# Altium schematic sheet Display_System_sch.SchDoc
size A3
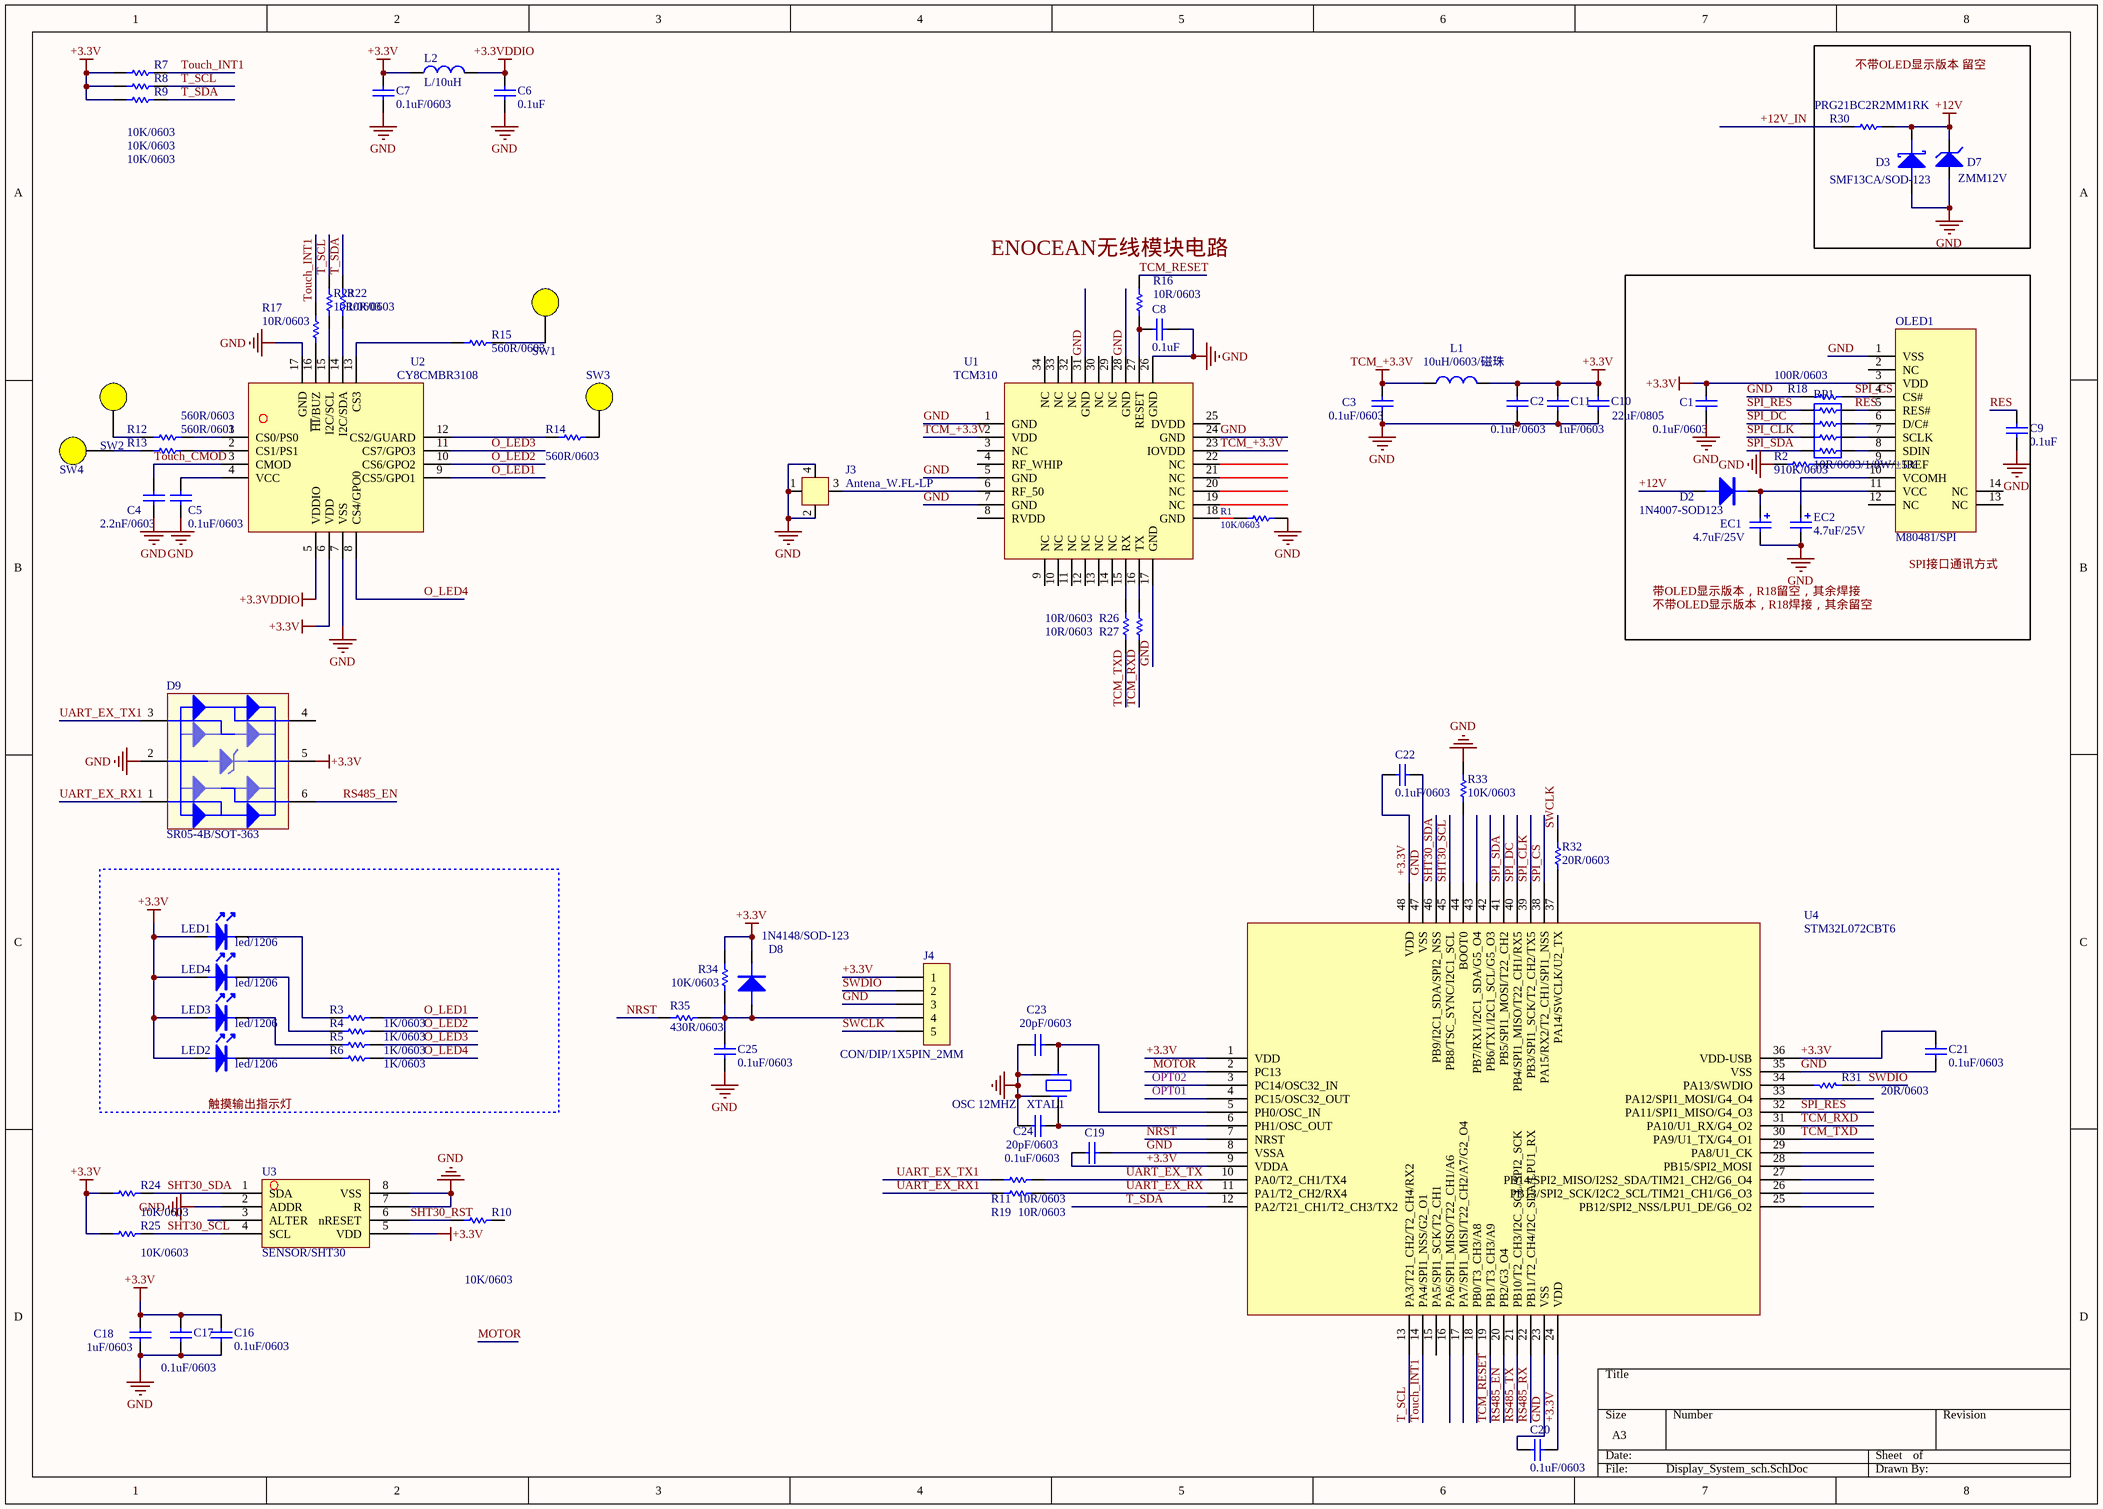
[diagram p0: Display_System_sch.SchDoc]

## Parts
C1  0.1uF/0603  [CAP/SMT/0603C]
C2  0.1uF/0603  [CAP/SMT/0603C]
C3  0.1uF/0603  [CAP/SMT/0603C]
C4  2.2nF/0603  [CAP/SMT/0603C]
C5  0.1uF/0603  [CAP/SMT/0603C]
C6  0.1uF  [CAP/SMT/0603C]
C7  0.1uF/0603  [CAP/SMT/0603C]
C8  0.1uF  [CAP/SMT/0603C]
C9  0.1uF  [CAP/SMT/0603C]
C10  22uF/0805  [CAP/SMT/0805C]
C11  1uF/0603  [CAP/SMT/0603C]
C16  0.1uF/0603  [CAP/SMT/0603C]
C17  0.1uF/0603  [CAP/SMT/0603C]
C18  1uF/0603  [CAP/SMT/0603C]
C19  0.1uF/0603  [CAP/SMT/0603C]
C20  0.1uF/0603  [CAP/SMT/0603C]
C21  0.1uF/0603  [CAP/SMT/0603C]
C22  0.1uF/0603  [CAP/SMT/0603C]
C23  20pF/0603  [CAP/SMT/0603C]
C24  20pF/0603  [CAP/SMT/0603C]
C25  0.1uF/0603  [CAP/SMT/0603C]
D2  1N4007-SOD123  [D/SMT/SOD123]
D3  SMF13CA/SOD-123  [D/SMT/SOD123]
D7  ZMM12V  [D/SMT/SOD-80]
D8  1N4148/SOD-123  [D/SMT/SOD-123]
D9  SR05-4B/SOT-363  [TSOT-6L]
EC1  4.7uF/25V  [CAP/SMT/TAJA106M010RNJ]
EC2  4.7uF/25V  [CAP/SMT/TAJA106M010RNJ]
J3  Antena_W.FL-LP  [W.FL.LP-3MM]
J4  CON/DIP/1X5PIN_2MM  [CON/DIP/1X5PIN/1.27MM]
L1  10uH/0603/磁珠  [0603R]
L2  L/10uH  [L/SMT/0603L]
LED1  led/1206  [D/SMT/LED/1206]
LED2  led/1206  [D/SMT/LED/1206]
LED3  led/1206  [D/SMT/LED/1206]
LED4  led/1206  [D/SMT/LED/1206]
OLED1  M80481/SPI  [OLED/M80481/6701]
R1  10K/0603  [0603R]
R2  910K/0603  [0603R]
R3  1K/0603  [0603R]
R4  1K/0603  [0603R]
R5  1K/0603  [0603R]
R6  1K/0603  [0603R]
R7  10K/0603  [0603R]
R8  10K/0603  [0603R]
R9  10K/0603  [0603R]
R10  10K/0603  [0603R]
R11  10R/0603  [0603R]
R12  560R/0603  [0603R]
R13  560R/0603  [0603R]
R14  560R/0603  [0603R]
R15  560R/0603  [0603R]
R16  10R/0603  [0603R]
R17  10R/0603  [0603R]
R18  100R/0603  [0603R]
R19  10R/0603  [0603R]
R22  10R/0603  [0603R]
R23  10R/0603  [0603R]
R24  10K/0603  [0603R]
R25  10K/0603  [0603R]
R26  10R/0603  [0603R]
R27  10R/0603  [0603R]
R30  PRG21BC2R2MM1RK  [0805R]
R31  20R/0603  [0603R]
R32  20R/0603  [0603R]
R33  10K/0603  [0603R]
R34  10K/0603  [0603R]
R35  430R/0603  [0603R]
RP1  10R/0603/1/8W/±5%  [0603R*4]
SW1  TOUCH  [SWITCH/TOUCH /四叶草]  (value not drawn)
SW2  TOUCH  [SWITCH/TOUCH /四叶草]  (value not drawn)
SW3  TOUCH  [SWITCH/TOUCH /四叶草]  (value not drawn)
SW4  TOUCH  [SWITCH/TOUCH /四叶草]  (value not drawn)
U1  TCM310  [TCM310]
U2  CY8CMBR3108  [QFN-16]
U3  SENSOR/SHT30  [SENSOR/SHT30]
U4  STM32L072CBT6  [TQFP48]
XTAL1  OSC 12MHZ  [OSC/SMT/12M]

## Nets
+3.3V: C1.2 C2.2 C7.2 C10.1 C11.2 C16.1 C17.2 C18.2 C19.2 C20.1 C21.2 C22.2 D8.1(K) D9.5 J4.1 L1.1 L2.1 LED1.2(A) LED2.2(A) LED3.2(A) LED4.2(A) OLED1.3(VDD) R7.1 R8.1 R9.1 R24.1 R25.1 R34.2 U2.6(VDD) U3.5(VDD) U4.1(VDD) U4.9(VDDA) U4.24(VDD) U4.36(VDD-USB) U4.48(VDD)
+3.3VDDIO: C6.2 L2.2 U2.5(VDDIO)
+12V: D2.2(A) D3.1(A) D7.1(K) R30.2
GND: C1.1 C2.1 C3.1 C4.1 C5.1 C6.1 C7.1 C8.1 C9.2 C10.2 C11.1 C16.2 C17.1 C18.1 C19.1 C20.2 C21.1 C22.1 C23.2 C24.2 C25.1 D3.2(K) D7.2(A) D9.2 EC1.2 EC2.2 J3.1(NC) J3.2(NC) J3.4(NC) J4.3 OLED1.1(VSS) R1.1 R2.1 R18.1 R33.1 U1.1(GND) U1.5(GND) U1.7(GND) U1.17(GND) U1.24(GND) U1.26(GND) U1.28(GND) U1.31(GND) U2.7(VSS) U2.17(GND) U3.2(ADDR) U3.7(R) U3.8(VSS) U4.8(VSSA) U4.23(VSS) U4.35(VSS) U4.47(VSS) XTAL1.2 XTAL1.4
TCM_+3.3V: C3.2 L1.2 U1.2(VDD) U1.23(IOVDD)
+12V_IN: R30.1
MOTOR: U4.2(PC13)
NRST: R35.2 U4.7(NRST)
O_LED1: R3.1 U2.9(CS5/GPO1)
O_LED2: R4.1 U2.10(CS6/GPO2)
O_LED3: R5.1 U2.11(CS7/GPO3)
O_LED4: R6.1 U2.8(CS4/GPO0)
OPT01: U4.4(PC15/OSC32_OUT)
OPT02: U4.3(PC14/OSC32_IN)
RES: C9.1 OLED1.5(RES#) RP1.4
RS485_EN: D9.6 U4.20(PB2/G3_O4)
RS485_RX: U4.22(PB11/T2_CH4/I2C_SDA/LPU1_RX)
RS485_TX: U4.21(PB10/T2_CH3/I2C_SCL/SPI2_SCK)
SHT30_RST: R10.1 U3.6(nRESET)
SHT30_SCL: R25.2 U3.4(SCL) U4.45(PB8/TSC_SYNC/I2C1_SCL)
SHT30_SDA: R24.2 U3.1(SDA) U4.46(PB9/I2C1_SDA/SPI2_NSS)
SPI_CLK: RP1.7 U4.39(PB3/SPI1_SCK/T2_CH2/TX5)
SPI_CS: OLED1.4(CS#) R18.2 U4.38(PA15/RX2/T2_CH1/SPI1_NSS)
SPI_DC: RP1.6 U4.40(PB4/SPI1_MISO/T22_CH1/RX5)
SPI_RES: RP1.5 U4.32(PA11/SPI1_MISO/G4_O3)
SPI_SDA: RP1.8 U4.41(PB5/SPI1_MOSI/T22_CH2)
SWCLK: J4.5 R32.2
SWDIO: J4.2 R31.1
T_SCL: R8.2 R23.1 U4.13(PA3/T21_CH2/T2_CH4/RX2)
T_SDA: R9.2 R22.1 U4.12(PA2/T21_CH1/T2_CH3/TX2)
TCM_RESET: R16.2 U4.19(PB1/T3_CH3/A9)
TCM_RXD: R27.1 U4.31(PA10/U1_RX/G4_O2)
TCM_TXD: R26.1 U4.30(PA9/U1_TX/G4_O1)
Touch_CMOD: C4.2 U2.3(CMOD)
Touch_INT1: R7.2 R17.2 U4.14(PA4/SPI1_NSS/G2_O1)
UART_EX_RX: R19.1 U4.11(PA1/T2_CH2/RX4)
UART_EX_RX1: D9.1 R19.2
UART_EX_TX: R11.1 U4.10(PA0/T2_CH1/TX4)
UART_EX_TX1: D9.3 R11.2
NetC5_2: C5.2 U2.4(VCC)
NetC8_2: C8.2 R16.1 U1.27(RESET)
NetC23_1: C23.1 U4.5(PH0/OSC_IN) XTAL1.3
NetC24_1: C24.1 U4.6(PH1/OSC_OUT) XTAL1.1
NetC25_2: C25.2 D8.2(A) J4.4 R34.1 R35.1
NetD2_1: D2.1(K) EC1.1 OLED1.11(VCC)
NetEC2_1: EC2.1 OLED1.10(VCOMH)
NetJ3_3: J3.3(NC) U1.6(RF_50)
NetLED1_1: LED1.1(K) R3.2
NetLED2_1: LED2.1(K) R6.2
NetLED3_1: LED3.1(K) R5.2
NetLED4_1: LED4.1(K) R4.2
NetOLED1_6: OLED1.6(D/C#) RP1.3
NetOLED1_7: OLED1.7(SCLK) RP1.2
NetOLED1_8: OLED1.8(SDIN) RP1.1
NetOLED1_9: OLED1.9(IREF) R2.2
NetR1_2: R1.2 U1.18(GND)
NetR12_1: R12.1 SW2.1
NetR12_2: R12.2 U2.1(CS0/PS0)
NetR13_1: R13.1 SW4.1
NetR13_2: R13.2 U2.2(CS1/PS1)
NetR14_1: R14.1 U2.12(CS2/GUARD)
NetR14_2: R14.2 SW3.1
NetR15_1: R15.1 U2.13(CS3)
NetR15_2: R15.2 SW1.1
NetR17_1: R17.1 U2.16(~{HI}/BUZ)
NetR22_2: R22.2 U2.14(I2C/SDA)
NetR23_2: R23.2 U2.15(I2C/SCL)
NetR26_2: R26.2 U1.15(RX)
NetR27_2: R27.2 U1.16(TX)
NetR31_2: R31.2 U4.34(PA13/SWDIO)
NetR32_1: R32.1 U4.37(PA14/SWCLK/U2_TX)
NetR33_2: R33.2 U4.44(BOOT0)

Not connected (* = marked no-connect by the designer): D9 4; OLED1 2(NC) 12(NC) 13(NC) 14(NC); R10 2; U1 3(NC) 4(RF_WHIP) 8(RVDD) 9(NC) 10(NC) 11(NC) 12(NC) 13(NC) 14(NC) 19(NC) 20(NC) 21(NC) 22(NC) 25(DVDD) 29(NC) 30(NC) 32(NC) 33(NC) 34(NC); U3 3(ALTER); U4 15(PA5/SPI1_SCK/T2_CH1) 16(PA6/SPI1_MISO/T22_CH1/A6) 17(PA7/SPI1_MISI/T22_CH2/A7/G2_O4) 18(PB0/T3_CH3/A8) 25(PB12/SPI2_NSS/LPU1_DE/G6_O2) 26(PB13/SPI2_SCK/I2C2_SCL/TIM21_CH1/G6_O3) 27(PB14/SPI2_MISO/I2S2_SDA/TIM21_CH2/G6_O4) 28(PB15/SPI2_MOSI) 29(PA8/U1_CK) 33(PA12/SPI1_MOSI/G4_O4) 42(PB6/TX1/I2C1_SCL/G5_O3) 43(PB7/RX1/I2C1_SDA/G5_O4)

## Notes on the sheet
- Labels drawn without touching a wire or pin: ENOCEAN无线模块电路, SPI接口通讯方式, 不带OLED显示版本 留空, 不带OLED显示版本，R18焊接，其余留空, 带OLED显示版本，R18留空，其余焊接, 触摸输出指示灯

## Library data of the parts
C1-C9 C11 C16-C25 = CAP/CAP/SMT/0603C
C10 = CAP/CAP/SMT/0805C
D2 = D/D/SMT/1N4007-SOD123
D3 = D/TVS/SMT/SMF13CA/SOD-123
D7 = D/ZENER/SMT/ZMM8V2/SOD80
D8 = D/D/SMT/1N4148/SOD-123: VR=75V T(-65-175)P(0.5W)VF=0.6V
D9 = D/TVS/SMT/SR05-4B/SOT-363
EC1 EC2 = CAP/TEC/SMT/TAJA106M010RNJ
J3 = OTHER/Antena
J4 = CON/DIP/1X5PIN_2MM: Connector
L1 = INDUCTOR1
L2 = L/BEAD/SMT/0603L
LED1-LED4 = D/LED/SMT/WEJT81GC/1206
OLED1 = OLED/M80481/SPI: OLED/M80481
R1 = Res: Resistor; Published: *; Publisher: *; Manufacturer: *; Class: *; SubClass: *; Value: *
R2-R19 R22-R27 R33-R35 = RES/RES/SMT/0603
R30 = RES/RES/SMT/0805
R31 = Res1: Resistor; Manufacturer: Generic Components; Class: Passive; Value: 1K; Published: 08/06/2000; Publisher: Altium Hobart Technology Centre; SubClass: Resistor
R32 = A_Res_0805: Resistor; Manufacturer: Generic Components; Class: Passive; Value: 1K; Published: 08/06/2000; Publisher: Altium Hobart Technology Centre; SubClass: Resistor
RP1 = RES /PACKS/SMT/0603*4: Isolated Resistor Network; Value: 1K; Published: 24-Mar-1999; LatestRevisionDate: 29-May-2009; LatestRevisionNote: IPC-7351 Footprint Added.; PackageReference: SO-16; Publisher: Altium Limited; PackageDescription: 16-Pin Small Outline Integrated Circuit 1.27 mm Pitch; Code_JEDEC: MS-012-AC; Code_IPC: SOIC127P600-16
SW1-SW4 = SWITCH/TOUCH/SMT/四叶草
U1 = TCM_310: PackageReference: *
U2 = IC/TOUCH/CY8CMBR3108/QFN16
U3 = SENSOR/SHT30: 温湿度传感器
U4 = MCU/SMT/STM32L072CBT6/LQFP48
XTAL1 = XTAL/SMT/OSC12MHZ-2